# Altium project LCD1202_SMD module.PrjPcb
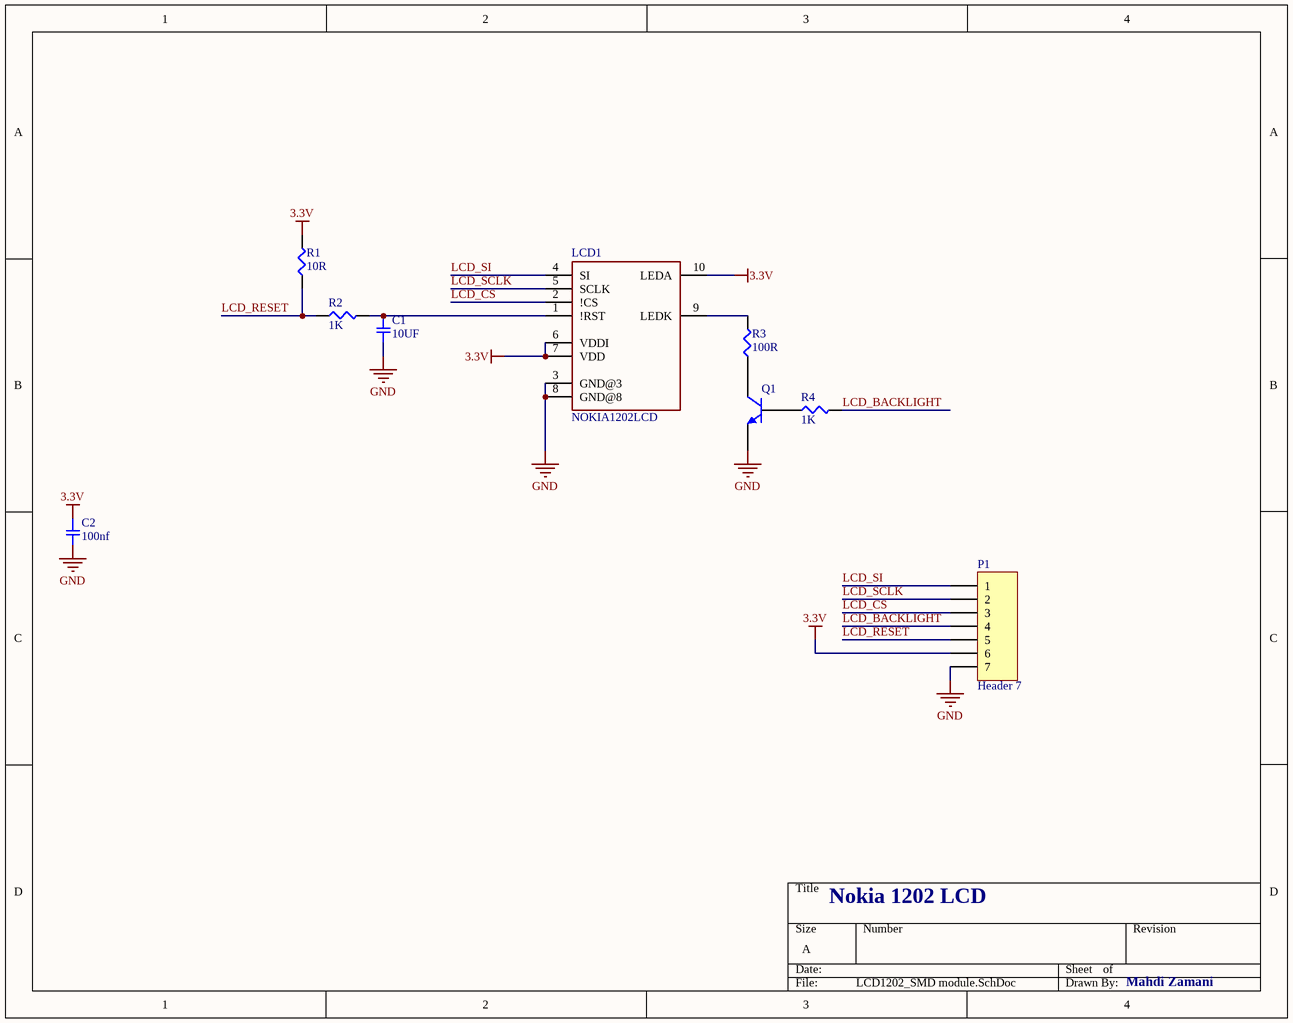
[diagram p0: LCD1202_SMD module.SchDoc]
1 sheet, 9 parts. Net scope: global (net labels, ports and power ports of the same name join across sheets).
Board file: N1202_LCD_module.PcbDoc

## Sheet LCD1202_SMD module.SchDoc
size A

### Parts
C1  10UF  [SMD-0805C]
C2  100nf  [SMD-0805C]
LCD1  NOKIA1202LCD  [LCD 1202 right]
P1  Header 7  [SMD SOLDER CONNECTOR X7]
Q1  BC817-25  [SOT23_BEC_M]  (value not drawn)
R1  10R  [SMD-0805-RES]
R2  1K  [SMD-0805-RES]
R3  100R  [SMD-0805-RES]
R4  1K  [SMD-0805-RES]

### Nets
3.3V: C2.1 LCD1.6(VDDI) LCD1.7(VDD) LCD1.10(LEDA) P1.6 R1.2
GND: C1.2 C2.2 LCD1.3(GND@3) LCD1.8(GND@8) P1.7 Q1.2(E)
LCD_BACKLIGHT: P1.4 R4.2
LCD_CS: LCD1.2(!CS) P1.3
LCD_RESET: P1.5 R1.1 R2.1
LCD_SCLK: LCD1.5(SCLK) P1.2
LCD_SI: LCD1.4(SI) P1.1
NetC1_1: C1.1 LCD1.1(!RST) R2.2
NetLCD1_9: LCD1.9(LEDK) R3.2
NetQ1_1: Q1.1(B) R4.1
NetQ1_3: Q1.3(C) R3.1

### Notes on the sheet
- Nokia 1202 LCD
- Mahdi Zamani

### Library data of the parts
C1 C2 = GC321AD72E103KX01D: CAP CER 10000PF 250V X7T 0805; Manufacturer: Murata Electronics North America; Factory Stock: 0; Unit Price (USD): 0.3; Minimum Quantity: 1; Tolerance: ±10%; Voltage: 50V; Datasheets: http://search.murata.co.jp/Ceramy/image/img/A01X/G101/ENG/GC321AD72E103KX01-01.pdf; Image: //media.digikey.com/Renders/Murata%20Renders/0805(GC3)200x125.jpg; Digi-Key Part Number: 490-13986-1-ND; Part Number: GC321AD72E103KX01D; Quantity Available: 4000; @ qty: 0; Packaging: Cut Tape (CT); Series: GC3; Part Status: Active; Temperature Coefficient: X7T; Operating Temperature: -55°C ~ 125°C; Features: -; Ratings: AEC-Q200; Applications: Automotive; Mounting Type: Surface Mount, MLCC; Package / Case: 0805 (2012 Metric); Size / Dimension: 0.079" L x 0.049" W (2.00mm x 1.25mm); Height - Seated (Max): -; Thickness (Max): 0.039" (1.00mm); Lead Spacing: -; Lead Style: -
  C1: Value: 10UF
  C2: Value: 100nf
LCD1 = LCD1202-EXT
P1 = Header 7: Header, 7-Pin; LatestRevisionDate: 17-Jul-2002; LatestRevisionNote: Re-released for DXP Platform.; Publisher: Altium Limited
Q1 = BC817-25: NPN General Purpose Amplifier; Published: 8-Jun-2000; LatestRevisionDate: 20-Nov-2009; LatestRevisionNote: IPC-7351 Footprint Added.; DatasheetVersion: 1997; PackageVersion: Sep-1998; PackageReference: SOT-23A; Publisher: Altium Limited; PackageDescription: 3-Pin SOT-23 Package 0.95 mm Pitch, 2.3 mm Lead Span; ComponentLink1Description: Manufacturer Link; ComponentLink1URL: http://www.fairchildsemi.com/; ComponentLink2Description: Discontinuation Notice; ComponentLink2URL: http://www.fairchildsemi.com/obsolete/obs.jsp
R1-R4 = ERJ-6BQF1R0V: RES SMD 1 OHM 1% 1/3W 0805; Manufacturer: Panasonic Electronic Components; Factory Stock: 0; Unit Price (USD): 0.05834; @ qty: 1500; Minimum Quantity: 1; Power (Watts): 0.333W, 1/3W; Temperature Coefficient: ±200ppm/°C; Part Number: ERJ-6BQF1R0V; Datasheets: https://industrial.panasonic.com/cdbs/www-data/pdf/RDA0000/AOA0000C239.pdf; Image: //media.digikey.com/Renders/Panasonic%20Renders/ERJ-0805%20Pkg.jpg; Digi-Key Part Number: P17499CT-ND; Quantity Available: 808; Packaging: Cut Tape (CT); Series: ERJ; Part Status: Active; Tolerance: ±1%; Composition: Thick Film; Features: Automotive AEC-Q200, Current Sense; Operating Temperature: -55°C ~ 125°C; Package / Case: 0805 (2012 Metric); Supplier Device Package: 0805; Size / Dimension: 0.079" L x 0.049" W (2.00mm x 1.25mm); Height - Seated (Max): 0.028" (0.70mm); Number of Terminations: 2; Failure Rate: -
  R1: Value: 10R
  R2 R4: Value: 1K
  R3: Value: 100R